# Altium project Mini51.PrjPCB
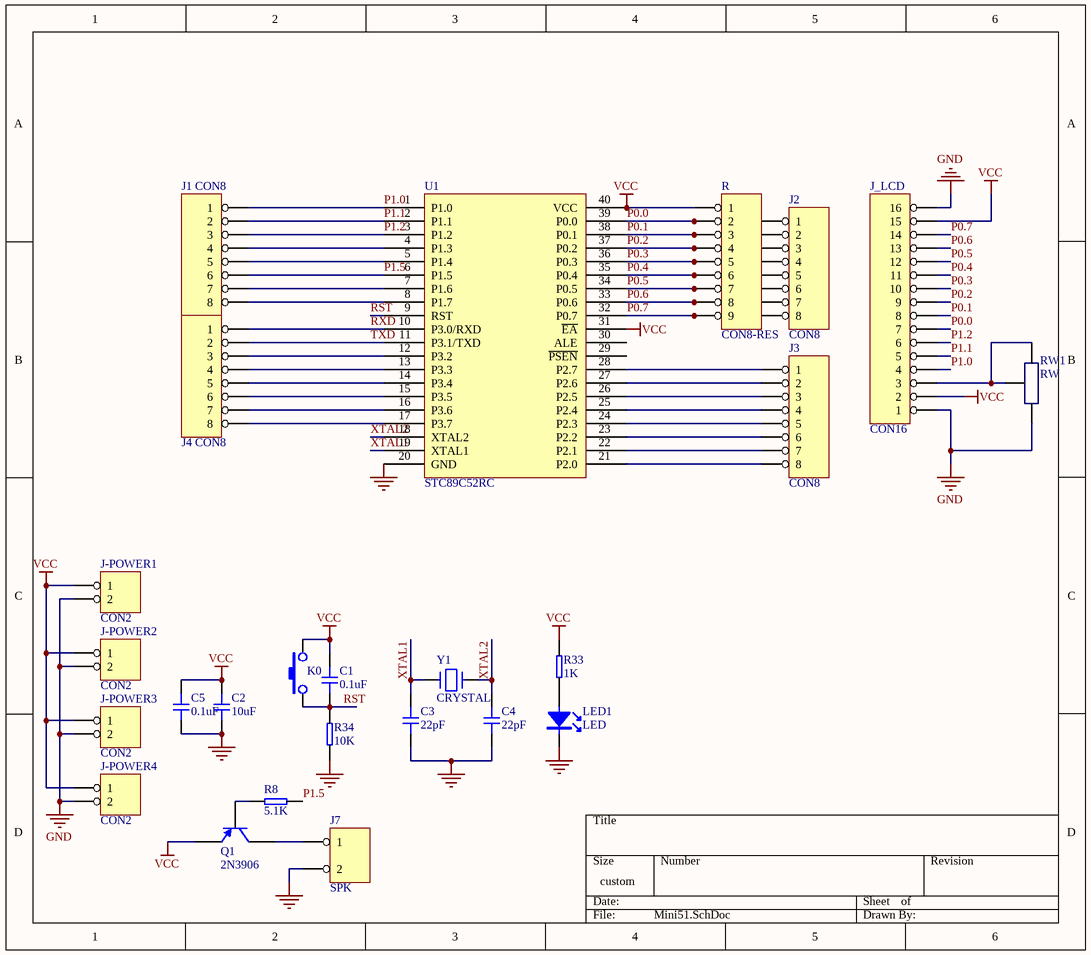
[diagram p0: Mini51.SchDoc]
1 sheet, 25 parts. Net scope: global (net labels, ports and power ports of the same name join across sheets).
Board file: Mini51.PcbDoc

## Sheet Mini51.SchDoc
size 203 x 177 mm

### Parts
C1  0.1uF  [0805]
C2  10uF  [0805]
C3  22pF  [0805]
C4  22pF  [0805]
C5  0.1uF  [0805]
J1  CON8  [SIP8]
J2  CON8  [SIP8]
J3  CON8  [SIP8]
J4  CON8  [SIP8]
J7  SPK  [SPK]
J-POWER1  CON2  [SIP2]
J-POWER2  CON2  [SIP2]
J-POWER3  CON2  [SIP2]
J-POWER4  CON2  [SIP2]
J_LCD  CON16  [SIP16]
K0  KEY  [KEY-6*6]  (value not drawn)
LED1  LED  [0805LD]
Q1  2N3906  [TO-92A]
R  CON8-RES  [SIP8-RES]
R8  5.1K  [0805]
R33  1K  [0805]
R34  10K  [0805]
RW1  RW  [RW]
U1  STC89C52RC  [DIP40]
Y1  CRYSTAL  [XTAL-2]

### Nets
GND: C2.1 C3.1 C4.1 C5.1 J7.2 J-POWER1.2 J-POWER2.2 J-POWER3.2 J-POWER4.2 J_LCD.1 J_LCD.16 LED1.K R34.1 RW1.2 U1.20(GND)
VCC: C1.2 C2.2 C5.2 J-POWER1.1 J-POWER2.1 J-POWER3.1 J-POWER4.1 J_LCD.2 J_LCD.15 K0.2 Q1.1(E) R.1 R33.2 U1.31(~{EA}) U1.40(VCC)
P0.0: J2.1 J_LCD.7 R.2 U1.39(P0.0)
P0.1: J2.2 J_LCD.8 R.3 U1.38(P0.1)
P0.2: J2.3 J_LCD.9 R.4 U1.37(P0.2)
P0.3: J2.4 J_LCD.10 R.5 U1.36(P0.3)
P0.4: J2.5 J_LCD.11 R.6 U1.35(P0.4)
P0.5: J2.6 J_LCD.12 R.7 U1.34(P0.5)
P0.6: J2.7 J_LCD.13 R.8 U1.33(P0.6)
P0.7: J2.8 J_LCD.14 R.9 U1.32(P0.7)
P1.0: J1.1 J_LCD.4 U1.1(P1.0)
P1.1: J1.2 J_LCD.5 U1.2(P1.1)
P1.2: J1.3 J_LCD.6 U1.3(P1.2)
P1.5: J1.6 R8.1 U1.6(P1.5)
RST: C1.1 K0.1 R34.2 U1.9(RST)
RXD: J4.1 U1.10(P3.0/RXD)
TXD: J4.2 U1.11(P3.1/TXD)
XTAL1: C3.2 U1.19(XTAL1) Y1.1
XTAL2: C4.2 U1.18(XTAL2) Y1.2
NetJ1_4: J1.4 U1.4(P1.3)
NetJ1_5: J1.5 U1.5(P1.4)
NetJ1_7: J1.7 U1.7(P1.6)
NetJ1_8: J1.8 U1.8(P1.7)
NetJ3_1: J3.1 U1.28(P2.7)
NetJ3_2: J3.2 U1.27(P2.6)
NetJ3_3: J3.3 U1.26(P2.5)
NetJ3_4: J3.4 U1.25(P2.4)
NetJ3_5: J3.5 U1.24(P2.3)
NetJ3_6: J3.6 U1.23(P2.2)
NetJ3_7: J3.7 U1.22(P2.1)
NetJ3_8: J3.8 U1.21(P2.0)
NetJ4_3: J4.3 U1.12(P3.2)
NetJ4_4: J4.4 U1.13(P3.3)
NetJ4_5: J4.5 U1.14(P3.4)
NetJ4_6: J4.6 U1.15(P3.5)
NetJ4_7: J4.7 U1.16(P3.6)
NetJ4_8: J4.8 U1.17(P3.7)
NetJ7_1: J7.1 Q1.3(C)
NetJ_LCD_3: J_LCD.3 RW1.1 RW1.3
NetLED1_A: LED1.A R33.1
NetQ1_2: Q1.2(B) R8.2

Not connected (* = marked no-connect by the designer): U1 29(~{PSEN}) 30(ALE)

### Library data of the parts
C1-C5 = CAP
J1-J4 = CON8: Connector 8p
K0 = KEY: push-button
LED1 = LED: Light-Emitting Diode
Q1 = 2N3906: PNP General Purpose Amplifier; Published: 8-Jun-2000; LatestRevisionDate: 15-Jan-2003; LatestRevisionNote: PCB Footprint 'BCY-W3/D4.7' replaced; DatasheetVersion: 1997; PackageVersion: Sep-1998; PackageReference: TO-92A; Publisher: Altium Limited; PackageDescription: TO, Flat Index; 3 In-Line, Axial Leads; Body Dia. 4.5mm; Leads 0.51 x 0.48 mm (max); ComponentLink1Description: Manufacturer Link; ComponentLink1URL: http://www.fairchildsemi.com/; ComponentLink2Description: Datasheet; ComponentLink2URL: http://www.fairchildsemi.com/ds/2N%2F2N3906.pdf
R = CON8-RES: Connector 8p
R8 R33 R34 = RES
RW1 = RW: 10K
U1 = STC89C52